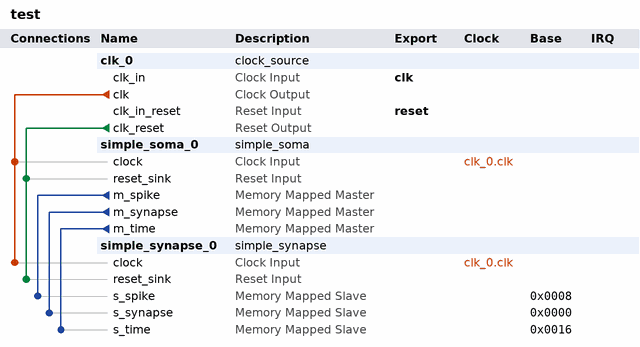
[diagram p0: system contents]
# Platform Designer (Qsys) system test, Cyclone V 5CSEBA6U23I7
# Parameters at their usual value, and those the tool derives, are not listed.
package require -exact qsys 21.1
create_system test
set_project_property DEVICE_FAMILY {Cyclone V}
set_project_property DEVICE 5CSEBA6U23I7

add_instance clk_0 clock_source 21.1
set_instance_parameter_value clk_0 clockFrequency 50000000

add_instance simple_soma_0 simple_soma 1.0.1
set_instance_parameter_value simple_soma_0 THRESHOLD 10
set_instance_parameter_value simple_soma_0 TIME_WIDTH 8

add_instance simple_synapse_0 simple_synapse 1.0.1
set_instance_parameter_value simple_synapse_0 THRESHOLD 10
set_instance_parameter_value simple_synapse_0 TIME_WIDTH 8

# connections
add_connection clk_0.clk simple_soma_0.clock clock
add_connection clk_0.clk simple_synapse_0.clock clock
add_connection clk_0.clk_reset simple_soma_0.reset_sink reset
add_connection clk_0.clk_reset simple_synapse_0.reset_sink reset
add_connection simple_soma_0.m_spike simple_synapse_0.s_spike avalon
set_connection_parameter_value simple_soma_0.m_spike/simple_synapse_0.s_spike baseAddress 0x0008
set_connection_parameter_value simple_soma_0.m_spike/simple_synapse_0.s_spike defaultConnection true
add_connection simple_soma_0.m_synapse simple_synapse_0.s_synapse avalon
set_connection_parameter_value simple_soma_0.m_synapse/simple_synapse_0.s_synapse baseAddress 0x0000
set_connection_parameter_value simple_soma_0.m_synapse/simple_synapse_0.s_synapse defaultConnection true
add_connection simple_soma_0.m_time simple_synapse_0.s_time avalon
set_connection_parameter_value simple_soma_0.m_time/simple_synapse_0.s_time baseAddress 0x0016
set_connection_parameter_value simple_soma_0.m_time/simple_synapse_0.s_time defaultConnection true

# exported interfaces
add_interface clk clock sink
set_interface_property clk EXPORT_OF clk_0.clk_in
add_interface reset reset sink
set_interface_property reset EXPORT_OF clk_0.clk_in_reset

set_interconnect_requirement {$system} qsys_mm.clockCrossingAdapter HANDSHAKE
set_interconnect_requirement {$system} qsys_mm.enableEccProtection FALSE
set_interconnect_requirement {$system} qsys_mm.insertDefaultSlave FALSE
set_interconnect_requirement {$system} qsys_mm.maxAdditionalLatency 1

save_system test.qsys
